# Altium schematic sheet QCopterMV_SD_Sch.SchDoc: QCopterMV-SD
size 127 x 101 mm; Author: Hom; CompanyName: KitSprout; DrawnBy: Hom; Engineer: Hom; Organization: KitSprout; Revision: A; SheetNumber: 1; SheetTotal: 1; License: CC BY-SA 4.0; Version: 2.0; LibVersion: 2.7; PageSetup: Record=PageOptions|CenterHorizontal=True|CenterVertical=True|PrintScale=1.00|XCorrection=1.00|YCorrection=1.00|PrintKind=0|BorderSize=5000000|LeftOffset=0|BottomOffset=0|Orientation=2|PaperLength=1000|PaperWidth=1000|Scale=100|PaperSource=7|PrintQuality=-4|MediaType=1|DitherType=10|PaperKind=A4|PrintScaleMode=0
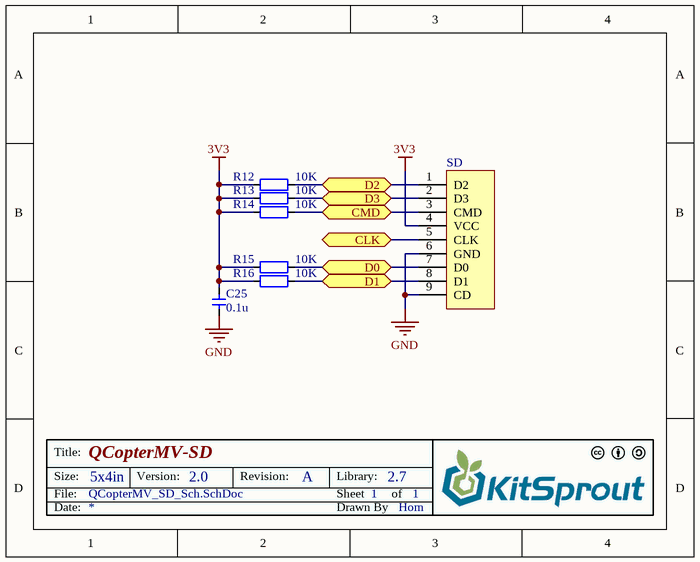
[diagram p0: QCopterMV_SD_Sch.SchDoc]

## Parts
C25  value 0.1u  [CAP_0402]  (hidden comment: Cap_0402)
R12  value 10K  [RES_0402]  (hidden comment: Res_0402)
R13  value 10K  [RES_0402]  (hidden comment: Res_0402)
R14  value 10K  [RES_0402]  (hidden comment: Res_0402)
R15  value 10K  [RES_0402]  (hidden comment: Res_0402)
R16  value 10K  [RES_0402]  (hidden comment: Res_0402)
SD  SD_Card_TF  [SD_Card_TF]  (value not drawn)

## Ports
CLK, CMD, D0, D1, D2, D3

## Nets
3V3: C25.2 R12.1 R13.1 R14.1 R15.1 R16.1 SD.4(VCC)
GND: C25.1 SD.6(GND) SD.9(CD)
CLK: SD.5(CLK) ; port CLK
CMD: R14.2 SD.3(CMD) ; port CMD
D0: R15.2 SD.7(D0) ; port D0
D1: R16.2 SD.8(D1) ; port D1
D2: R12.2 SD.1(D2) ; port D2
D3: R13.2 SD.2(D3) ; port D3

## Notes on the sheet
- Title:
- Size:
- Date:
- File:
- 5x4in
- Version:
- Revision:
- Sheet
- Drawn By
- Library:
- of

## Library data of the parts
C25 = Cap_0402: Capacitor
R12-R16 = Res_0402: Resistor
SD = SD_Card_TF: SD